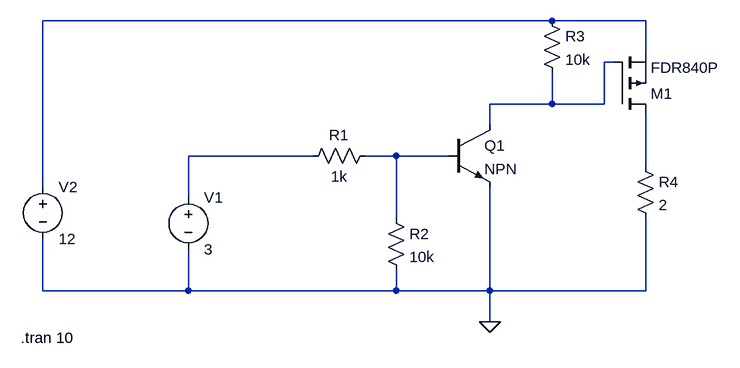
[diagram p0: schematic PowerEn.asc]
PowerEn.asc, the LTspice schematic file:
Version 4
SHEET 1 880 680
WIRE 192 -272 -592 -272
WIRE 336 -272 192 -272
WIRE 336 -224 336 -272
WIRE 288 -208 272 -208
WIRE 192 -144 192 -192
WIRE 192 -144 96 -144
WIRE 272 -144 272 -208
WIRE 272 -144 192 -144
WIRE 96 -112 96 -144
WIRE -176 -64 -368 -64
WIRE -48 -64 -96 -64
WIRE 32 -64 -48 -64
WIRE 336 -48 336 -128
WIRE -592 -16 -592 -272
WIRE -368 0 -368 -64
WIRE -48 32 -48 -64
WIRE -592 144 -592 64
WIRE -368 144 -368 80
WIRE -368 144 -592 144
WIRE -48 144 -48 112
WIRE -48 144 -368 144
WIRE 96 144 96 -16
WIRE 96 144 -48 144
WIRE 336 144 336 32
WIRE 336 144 96 144
WIRE 96 192 96 144
FLAG 96 192 0
SYMBOL npn 32 -112 R0
SYMATTR InstName Q1
SYMBOL res -80 -80 R90
WINDOW 0 0 56 VBottom 2
WINDOW 3 32 56 VTop 2
SYMATTR InstName R1
SYMATTR Value 1k
SYMBOL voltage -368 -16 R0
WINDOW 123 0 0 Left 0
WINDOW 39 0 0 Left 0
SYMATTR InstName V1
SYMATTR Value 3
SYMBOL res -64 16 R0
SYMATTR InstName R2
SYMATTR Value 10k
SYMBOL res 176 -288 R0
SYMATTR InstName R3
SYMATTR Value 10k
SYMBOL res 320 -64 R0
SYMATTR InstName R4
SYMATTR Value 2
SYMBOL voltage -592 -32 R0
WINDOW 123 0 0 Left 0
WINDOW 39 0 0 Left 0
SYMATTR InstName V2
SYMATTR Value 12
SYMBOL pmos 288 -128 M180
SYMATTR InstName M1
SYMATTR Value FDR840P
TEXT -626 216 Left 2 !.tran 10

The netlist it stands for:
* PowerEn.asc
Q1 N002 N004 0 0 NPN
R1 N004 N003 1k
V1 N003 0 3
R2 N004 0 10k
R3 N001 N002 10k
R4 N005 0 2
V2 N001 0 12
M1 N005 N002 N001 N001 FDR840P
.model NPN NPN
.model PNP PNP
.lib standard.bjt
.model NMOS NMOS
.model PMOS PMOS
.lib standard.mos
.tran 10
.backanno
.end